# EasyEDA schematic AC_RTU.json
TITLE: O24U - AC RTU; REV: 1.0; Date: 2021-08-14; Sheet: 1/1; Drawn By: mjkoster; Company: Dogtiger Labs
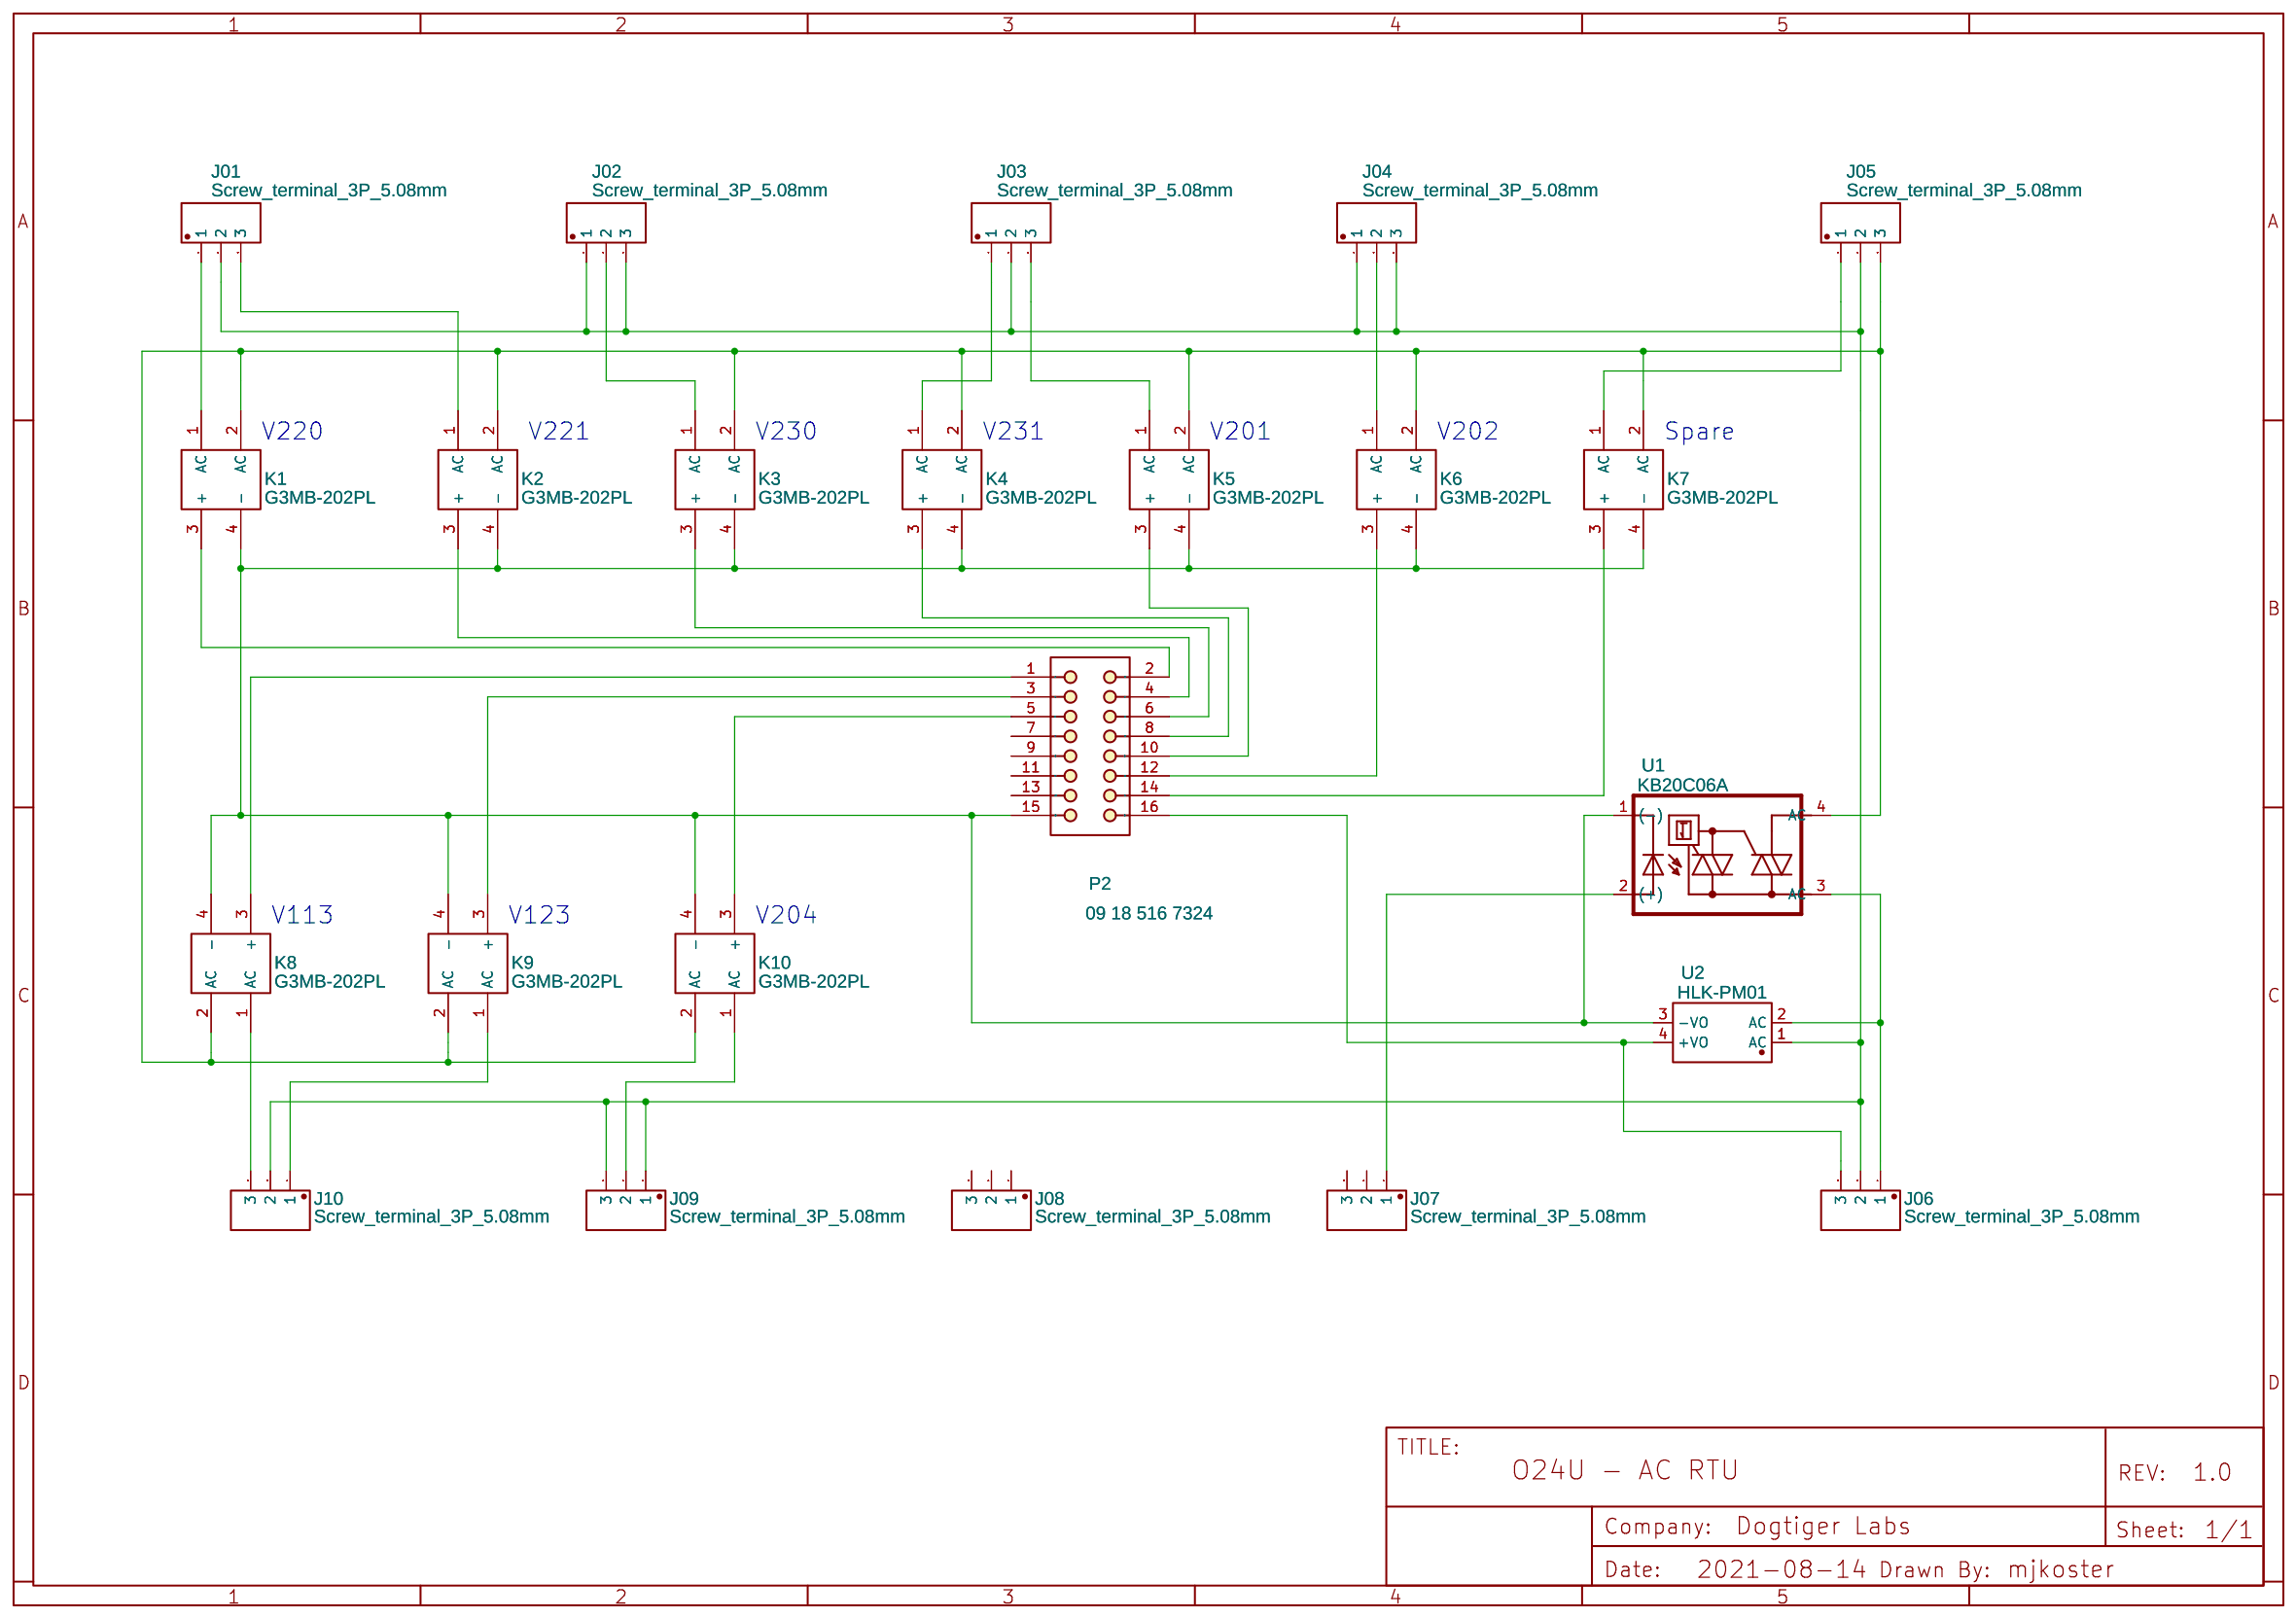
[diagram p0: schematic sheet]

## Parts
J01  Screw_terminal_3P_5.08mm  [SCREW_TERMINAL_3P_5.08]
J02  Screw_terminal_3P_5.08mm  [SCREW_TERMINAL_3P_5.08]
J03  Screw_terminal_3P_5.08mm  [SCREW_TERMINAL_3P_5.08]
J04  Screw_terminal_3P_5.08mm  [SCREW_TERMINAL_3P_5.08]
J05  Screw_terminal_3P_5.08mm  [SCREW_TERMINAL_3P_5.08]
J06  Screw_terminal_3P_5.08mm  [SCREW_TERMINAL_3P_5.08]
J07  Screw_terminal_3P_5.08mm  [SCREW_TERMINAL_3P_5.08]
J08  Screw_terminal_3P_5.08mm  [SCREW_TERMINAL_3P_5.08]
J09  Screw_terminal_3P_5.08mm  [SCREW_TERMINAL_3P_5.08]
J10  Screw_terminal_3P_5.08mm  [SCREW_TERMINAL_3P_5.08]
K1  G3MB-202PL  [RELAY-TH_G3MB-202PL]
K2  G3MB-202PL  [RELAY-TH_G3MB-202PL]
K3  G3MB-202PL  [RELAY-TH_G3MB-202PL]
K4  G3MB-202PL  [RELAY-TH_G3MB-202PL]
K5  G3MB-202PL  [RELAY-TH_G3MB-202PL]
K6  G3MB-202PL  [RELAY-TH_G3MB-202PL]
K7  G3MB-202PL  [RELAY-TH_G3MB-202PL]
K8  G3MB-202PL  [RELAY-TH_G3MB-202PL]
K9  G3MB-202PL  [RELAY-TH_G3MB-202PL]
K10  G3MB-202PL  [RELAY-TH_G3MB-202PL]
P2  09 18 516 7324  [918516X324]
U1  KB20C06A  [SSR_PCB_KB20]
U2  HLK-PM01  [PWRM-TH_HLK-PM01]

## Library data of the parts
J01 J02 J03 J04 J05 J06 J07 J08 J09 J10 = Screw_terminal_3P_5.08mm: Manufacturer Part: E-Simpo; Contributor: Roland Weber; Supplier: Amazon; link: https://www.amazon.com/Simpo-Terminal-terminal-connector-Material/dp/B07DG3GM42/ref=sr_1_1_sspa?ie=UTF8&qid=1532196005&sr=8-1-spons&keywords=screw+terminal+block+6+2.54mm&psc=1
K1-K10 = G3MB-202PL: Supplier: LCSC; Manufacturer: OMRON; Supplier Part: C48654; JLCPCB Part Class: Extended Part
P2 = 09 18 516 7324: Flat Cable Connector (IDC), Low-Profile Male Header, Straight Solder Pin, 16 Contacts, Performance Level 3
U1 = KB20
U2 = HLK-PM01: Supplier: LCSC; Supplier Part: C209903; Manufacturer: HI-LINK; Contributor: LCSC; JLCPCB Part Class: Extended Part

## Nets
Net-(J01-1): J01.1 K1.1(AC)
Net-(J01-2): J01.2 J02.1 J02.3 J03.2 J04.1 J04.3 J05.2 J06.2 J09.1 J09.3 J10.2 U2.1(AC)
Net-(J01-3): J01.3 K2.1(AC)
Net-(J02-2): J02.2 K3.1(AC)
Net-(J03-1): J03.1 K4.1(AC)
Net-(J03-3): J03.3 K5.1(AC)
Net-(J04-2): J04.2 K6.1(AC)
Net-(J05-1): J05.1 K7.1(AC)
Net-(J05-3): J05.3 K1.2(AC) K2.2(AC) K3.2(AC) K4.2(AC) K5.2(AC) K6.2(AC) K7.2(AC) K8.2(AC) K9.2(AC) K10.2(AC) U1.4(AC)
Net-(J06-1): J06.1 U1.3(AC) U2.2(AC)
Net-(J06-3): J06.3 P2.16 U2.4(+VO)
Net-(J07-1): J07.1 U1.2((+))
Net-(J09-2): J09.2 K10.1(AC)
Net-(J10-1): J10.1 K9.1(AC)
Net-(J10-3): J10.3 K8.1(AC)
Net-(K1-3): K1.3(+) P2.2
Net-(K1-4): K1.4(-) K2.4(-) K3.4(-) K4.4(-) K5.4(-) K6.4(-) K7.4(-) K8.4(-) K9.4(-) K10.4(-) P2.15 U1.1((-)) U2.3(-VO)
Net-(K2-3): K2.3(+) P2.4
Net-(K3-3): K3.3(+) P2.6
Net-(K4-3): K4.3(+) P2.8
Net-(K5-3): K5.3(+) P2.10
Net-(K6-3): K6.3(+) P2.12
Net-(K7-3): K7.3(+) P2.14
Net-(K8-3): K8.3(+) P2.1
Net-(K9-3): K9.3(+) P2.3
Net-(K10-3): K10.3(+) P2.5

Not connected (* = marked no-connect by the designer): J07 2 3; J08 1 2 3; P2 7 9 11 13

## Notes on the sheet
- V220
- V221
- V230
- V231
- V201
- V202
- Spare
- V113
- V123
- V204
